# Altium project RemoteControl.PrjPCB
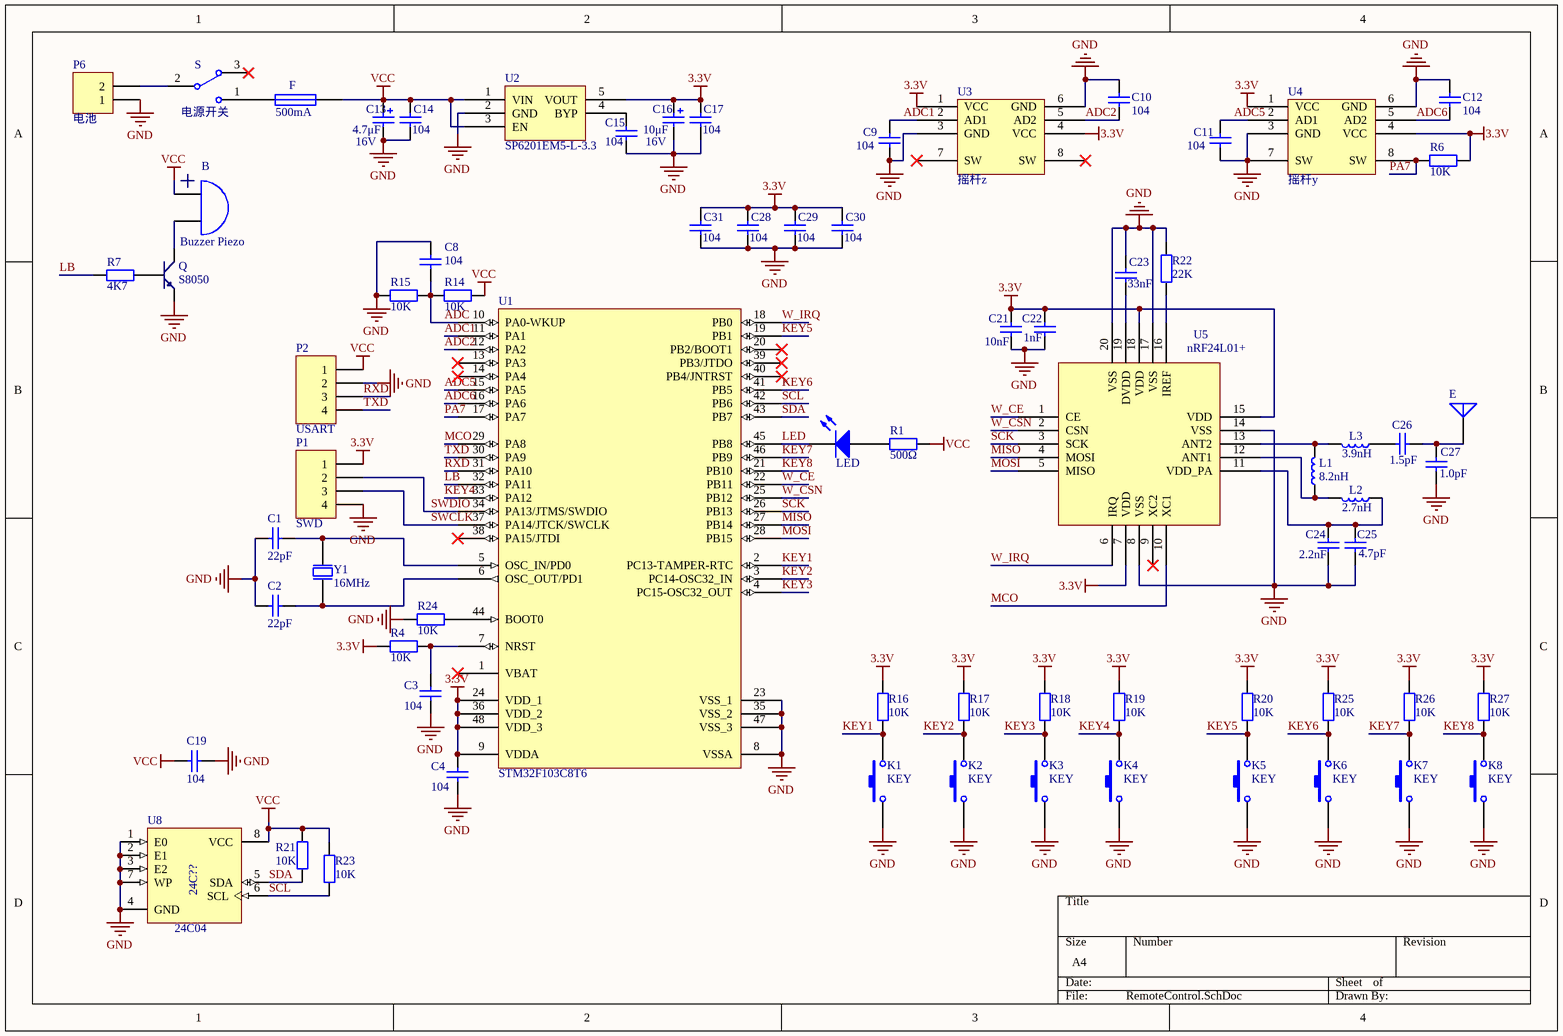
[diagram p0: RemoteControl.SchDoc]
1 sheet, 71 parts. Net scope: global (net labels, ports and power ports of the same name join across sheets).
Board file: RemoteControl.PcbDoc

## Sheet RemoteControl.SchDoc
size A4

### Parts
B  Buzzer Piezo  [BUZZER]
C1  22pF  [CC1608-0603]
C2  22pF  [CC1608-0603]
C3  104  [CC1608-0603]
C4  104  [CC1608-0603]
C8  104  [CC1608-0603]
C9  104  [CC1608-0603]
C10  104  [CC1608-0603]
C11  104  [CC1608-0603]
C12  104  [CC1608-0603]
C13  Voltage: 16V  [TAN-A-3216]  (hidden comment: 4.7μF)
C14  104  [CC1608-0603]
C15  104  [CC1608-0603]
C16  Voltage: 16V  [TAN-A-3216]  (hidden comment: 10μF)
C17  104  [CC1608-0603]
C19  104  [CC1608-0603]
C21  10nF  [CC1608-0603]
C22  1nF  [CC1608-0603]
C23  33nF  [CC1608-0603]
C24  2.2nF  [CC1608-0603]
C25  4.7pF  [CC1608-0603]
C26  1.5pF  [CC1608-0603]
C27  1.0pF  [CC1608-0603]
C28  104  [CC1608-0603]
C29  104  [CC1608-0603]
C30  104  [CC1608-0603]
C31  104  [CC1608-0603]
E  (no value)  [Chip Antenna]
F  500mA  [CR2012-0805]
K1  KEY  [KEY2]
K2  KEY  [KEY2]
K3  KEY  [KEY2]
K4  KEY  [KEY2]
K5  KEY  [KEY2]
K6  KEY  [KEY2]
K7  KEY  [KEY2]
K8  KEY  [KEY2]
L1  8.2nH  [CC1608[0603]]
L2  2.7nH  [CC1608[0603]]
L3  3.9nH  [CC1608[0603]]
LED  LED Chip  [CLED1608-0603]  (value not drawn)
P1  SWD  [HDR1X4]
P2  USART  [HDR1X4]
P6  电池  [HDR1X2]
Q  S8050  [SOT-23]
R1  500Ω  [CR1608-0603]
R4  10K  [CR1608-0603]
R6  10K  [CR1608-0603]
R7  value 4K7  [CR1608-0603]  (hidden comment: 10K)
R14  10K  [CR1608-0603]
R15  10K  [CR1608-0603]
R16  10K  [CR1608-0603]
R17  10K  [CR1608-0603]
R18  10K  [CR1608-0603]
R19  10K  [CR1608-0603]
R20  10K  [CR1608-0603]
R21  10K  [CR1608-0603]
R22  22K  [CR1608-0603]
R23  10K  [CR1608-0603]
R24  10K  [CR1608-0603]
R25  10K  [CR1608-0603]
R26  10K  [CR1608-0603]
R27  10K  [CR1608-0603]
S  电源开关  [MSK-12C02-1]
U1  STM32F103C8T6  [LQFP48_N]
U2  SP6201EM5-L-3.3  [SO-G5/NS]
U3  摇杆z  [摇杆]
U4  摇杆y  [摇杆]
U5  nRF24L01+  [QFN50P400X400-20V5N]
U8  24C04  [SOP-8N]
Y1  Frequency: 16MHz  [XTAL-PINGBI]  (hidden comment: 8MHz)

### Nets
3.3V: C4.2 C16.2 C17.2 C21.1 C22.1 C28.2 C29.2 C30.2 C31.2 P1.1 R4.1 R6.1 R16.2 R17.2 R18.2 R19.2 R20.2 R25.2 R26.2 R27.2 U1.9(VDDA) U1.24(VDD_1) U1.36(VDD_2) U1.48(VDD_3) U2.5(VOUT) U3.1(VCC) U3.4(VCC) U4.1(VCC) U4.4(VCC) U5.7(VDD) U5.15(VDD) U5.18(VDD)
GND: C1.1 C2.1 C3.1 C4.1 C8.1 C9.1 C10.2 C11.1 C12.2 C13.1 C14.1 C15.1 C16.1 C17.1 C19.2 C21.2 C22.2 C23.1 C24.2 C25.2 C27.1 C28.1 C29.1 C30.1 C31.1 K1.1 K2.1 K3.1 K4.1 K5.1 K6.1 K7.1 K8.1 P1.4 P2.2 P6.1 Q.1(E) R15.2 R22.2 R24.2 U1.8(VSSA) U1.23(VSS_1) U1.35(VSS_2) U1.47(VSS_3) U2.2(GND) U3.3(GND) U3.6(GND) U4.3(GND) U4.6(GND) U4.7(SW) U5.8(VSS) U5.14(VSS) U5.17(VSS) U5.20(VSS) U8.1(E0) U8.2(E1) U8.3(E2) U8.4(GND) U8.7(WP)
VCC: B.1(A) C13.2 C14.2 C19.1 F.2 P2.1 R1.1 R14.1 R21.2 R23.2 U2.1(VIN) U2.3(EN) U8.8(VCC)
ADC: C8.2 R14.2 R15.1 U1.10(PA0-WKUP)
ADC1: C9.2 U1.11(PA1) U3.2(AD1)
ADC2: C10.1 U1.12(PA2) U3.5(AD2)
ADC5: C11.2 U1.15(PA5) U4.2(AD1)
ADC6: C12.1 U1.16(PA6) U4.5(AD2)
KEY1: K1.2 R16.1 U1.2(PC13-TAMPER-RTC)
KEY2: K2.2 R17.1 U1.3(PC14-OSC32_IN)
KEY3: K3.2 R18.1 U1.4(PC15-OSC32_OUT)
KEY4: K4.2 R19.1 U1.33(PA12)
KEY5: K5.2 R20.1 U1.19(PB1)
KEY6: K6.2 R25.1 U1.41(PB5)
KEY7: K7.2 R26.1 U1.46(PB9)
KEY8: K8.2 R27.1 U1.21(PB10)
LB: R7.2 U1.32(PA11)
LED: LED.2(K) U1.45(PB8)
MCO: U1.29(PA8) U5.10(XC1)
MISO: U1.27(PB14) U5.4(MOSI)
MOSI: U1.28(PB15) U5.5(MISO)
PA7: R6.2 U1.17(PA7) U4.8(SW)
RXD: P2.3 U1.31(PA10)
SCK: U1.26(PB13) U5.3(SCK)
SCL: R23.1 U1.42(PB6) U8.6(SCL)
SDA: R21.1 U1.43(PB7) U8.5(SDA)
SWCLK: P1.3 U1.37(PA14/JTCK/SWCLK)
SWDIO: P1.2 U1.34(PA13/JTMS/SWDIO)
TXD: P2.4 U1.30(PA9)
W_CE: U1.22(PB11) U5.1(CE)
W_CSN: U1.25(PB12) U5.2(CSN)
W_IRQ: U1.18(PB0) U5.6(IRQ)
NetB_2: B.2(B) Q.3(C)
NetC1_2: C1.2 U1.5(OSC_IN/PD0) Y1.2(OSC2)
NetC2_2: C2.2 U1.6(OSC_OUT/PD1) Y1.1(OSC1)
NetC3_2: C3.2 R4.2 U1.7(NRST)
NetC15_2: C15.2 U2.4(BYP)
NetC23_2: C23.2 U5.19(DVDD)
NetC24_1: C24.1 C25.1 L2.1 U5.11(VDD_PA)
NetC26_1: C26.1 L3.1
NetC26_2: C26.2 C27.2 E.1(A)
NetF_1: F.1 S.1
NetL1_1: L1.1 L2.2 U5.12(ANT1)
NetL1_2: L1.2 L3.2 U5.13(ANT2)
NetLED_1: LED.1(A) R1.2
NetP6_2: P6.2 S.2
NetQ_2: Q.2(B) R7.1
NetR22_1: R22.1 U5.16(IREF)
NetR24_1: R24.1 U1.44(BOOT0)

Not connected (* = marked no-connect by the designer): S 3*; U1 1(VBAT)* 13(PA3)* 14(PA4)* 20(PB2/BOOT1)* 38(PA15/JTDI)* 39(PB3/JTDO)* 40(PB4/JNTRST)*; U3 7(SW)* 8(SW)*; U5 9(XC2)*

### Notes on the sheet
- (in symbol 24CXXSOP) 24C??

### Library data of the parts
B = Buzzer: Electrical Bell; Published: 24-Mar-1999; LatestRevisionDate: 17-Jul-2002; LatestRevisionNote: Re-released for DXP Platform.; PackageReference: PIN2; Publisher: Altium Limited
C1-C4 C8-C12 C14 C15 C17 C21-C31 = Cap: Capacitor; Published: 8-Jun-2000; LatestRevisionDate: 17-Jul-2002; LatestRevisionNote: Re-released for DXP Platform.; PackageReference: RAD-0.3; Publisher: Altium Limited; PackageDescription: Radial Cap, Thru-Hole; 2 Leads; 0.3 in Pin Spacing
  C1 C2: Value: 22pF
  C3 C4 C8-C12 C14 C15 C17 C28-C31: Value: 104
  C21: Value: 10nF
  C22: Value: 1nF
  C23: Value: 33nF
  C24: Value: 2.2nF
  C25: Value: 4.7pF
  C26: Value: 1.5pF
  C27: Value: 1.0pF
C13 C16 = Cap Tan: Polarized Capacitor (Radial); Published: 8-Jun-2000; Revision: July-2002: Re-released for DXP Platform.; Publisher: Altium Limited
  C13: Value: 4.7μF
  C16: Value: 10μF
C19 = Cap Chip: Polarized Capacitor (Radial); Published: 8-Jun-2000; Revision: July-2002: Re-released for DXP Platform.; Publisher: Altium Limited
E = Antenna: Generic Antenna; Published: 24-Mar-1999; LatestRevisionDate: 17-Jul-2002; LatestRevisionNote: Re-released for DXP Platform.; PackageReference: PIN1; Publisher: Altium Limited
F = Fuse: Published: 8-Jun-2000; Revision: July-2002: Re-released for DXP Platform.; Publisher: Altium Limited
K1-K8 = KYE
L1-L3 = Inductor: Code_IEC: 1005; Published: 8-Jun-2000; LatestRevisionDate: 29-May-2009; LatestRevisionNote: IPC-7351 Footprint Added.; PackageReference: 0402-A; Publisher: Altium Limited; PackageDescription: Chip Inductor; Code_JEITA: 0402
  L1: Value: 8.2nH
  L2: Value: 2.7nH
  L3: Value: 3.9nH
LED = LED Chip: Typical Chip LED; Published: 8-Jun-2000; Revision: July-2002: Re-released for DXP Platform.; Publisher: Altium Limited
P1 P2 = Header 4: Header, 4-Pin; LatestRevisionDate: 17-Jul-2002; LatestRevisionNote: Re-released for DXP Platform.; Publisher: Altium Limited
P6 = Header 2: Header, 2-Pin; LatestRevisionDate: 17-Jul-2002; LatestRevisionNote: Re-released for DXP Platform.; Publisher: Altium Limited
Q = NPN: 8050/BCW846/BCW847
R1 R4 R6 R7 R14-R20 R22 R25-R27 = Resistor Chip: Resistor; Published: 8-Jun-2000; Revision: July-2002: Re-released for DXP Platform.; Publisher: Altium Limited
  R1: Value: 500Ω
  R4 R6 R14-R20 R25-R27: Value: 10K
  R22: Value: 22K
R21 R23 R24 = Resistor Axial: Resistor; Published: 8-Jun-2000; Revision: July-2002: Re-released for DXP Platform.; Publisher: Altium Limited
S = SW-SPDT: SPDT Subminiature Toggle Switch, Right Angle Mounting, Vertical Actuation; Published: 24-Mar-1999; LatestRevisionDate: 17-Dec-2003; LatestRevisionNote: Schematic revised, PCB Footprint replaced.; DatasheetVersion: 05-Dec-2000; PackageReference: TL36WW15050; Publisher: Altium Limited; PackageDescription: Switch; 4 Leads; ComponentLink1Description: Manufacturer Link; ComponentLink1URL: http://www.apem.com
U1 = STM32F103C8T6: STM32 ARM-based 32-bit MCU with 64 Kbytes Flash, 48-pin LQFP, Industrial Temperature; Published: *; DatasheetVersion: *; PackageVersion: *; PackageReference: *; Publisher: *; PackageDescription: *; ComponentLink1Description: *; ComponentLink1URL: *; ComponentLink2Description: *; ComponentLink2URL: *
U2 = PAM3101
U3 U4 = 摇杆
U8 = 24CXXSOP: ??Kbit Serial  Bus EEPROM; Published: 24-Aug-2001; LatestRevisionDate: 13-Apr-2006; LatestRevisionNote: IPC-7351 Footprint Added.; DatasheetVersion: Sep-1999; PackageVersion: Jul-1999; PackageReference: SOP8; Publisher: Altium Limited; PackageDescription: 8-Pin Small Outline Integrated Circuit 1.27 mm Pitch; ComponentLink1Description: Manufacturer Link; ComponentLink1URL: http://www.st.com/; ComponentLink2Description: Datasheet; ComponentLink2URL: http://www.st.com/stonline/products/literature/ds/5067/m24c01-r.pdf
Y1 = XTAL: Crystal Oscillator; Published: 8-Jun-2000; Revision: July-2002: Re-released for DXP Platform.; Publisher: Altium Limited